# EAGLE design v1.1 (EAGLE 9.0.1)
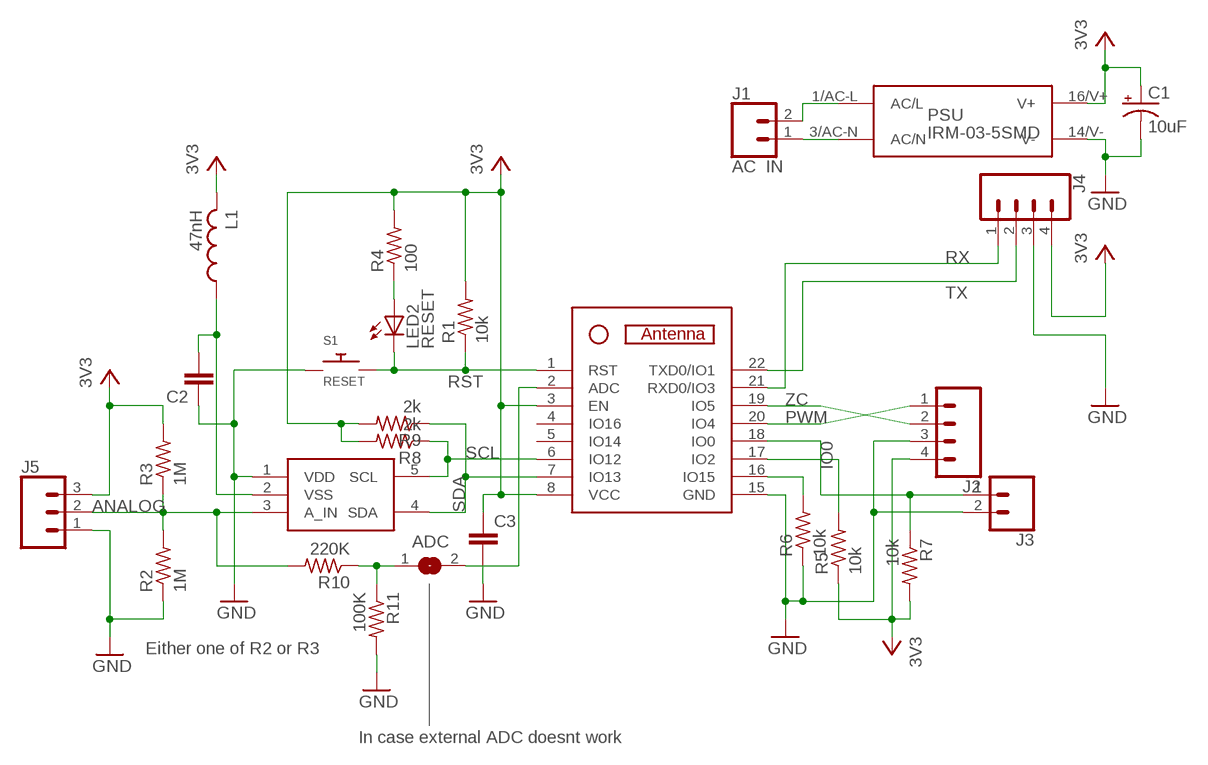
[diagram p0: schematic, sheet 1]

## Parts
ADC  SJ  [SJ]
C1  10uF  CPOL-US153CLV-0405  [153CLV-0405]
C2  C-EUC0805  [C0805]
C3  C-EUC0805  [C0805]
J1  AC IN  1X2_5MM_SCREW  [1X2_5MM_SCREW]
J2  CONN_04  [1X04]
J3  CONN_02  [1X02]
J4  CONN_04  [1X04]
J5  CONN_03  [1X03]
L1  47nH  L-USL2012C  [L2012C]
LED2  RESET  LEDSML0805  [SML0805]
PSU  IRM-03-5SMD  [IRM-03-5S]
R1  10k  R-US_R0603  [R0603]
R2  1M  R-US_R0603  [R0603]
R3  1M  R-US_R0603  [R0603]
R4  100  R-US_R0805  [R0805]
R5  10k  R-US_R0603  [R0603]
R6  10k  R-US_R0603  [R0603]
R7  10k  R-US_R0603  [R0603]
R8  2k  R-US_R0603  [R0603]
R9  2k  R-US_R0603  [R0603]
R10  220K  R-US_R0603  [R0603]
R11  100K  R-US_R0603  [R0603]
S1  RESET  BUTTON  [TACTILE_SWITCH_SMD_6.2MM_TALL]
U1  ESP-07  [ESP-07]
U2  MCP3221  [SOT23-5]

## Nets
AC/L: J1.2 PSU.1/AC-L(AC/L)
AC/N: J1.1 PSU.3/AC-N(AC/N)
ANALOG: J5.2 R2.2 R3.1 R10.2 U2.3(A_IN)
GND: C1.- C2.1 C3.2 J2.3 J3.2 J4.3 J5.1 PSU.14/V-(V-) R2.1 R6.1 R11.2 S1.A1 S1.A2 U1.15(GND) U2.1(VDD)
IO0: J3.1 R7.1 U1.18(IO0)
N$1: LED2.A R4.1
N$2: R5.2 U1.17(IO2)
N$3: R6.2 U1.16(IO15)
N$4: ADC.1 R10.1 R11.1
N$6: ADC.2 U1.2(ADC)
N$7: C2.2 L1.1 U2.2(VSS)
PWM: J2.1 U1.20(IO4)
RST: LED2.C R1.1 S1.B1 S1.B2 U1.1(RST)
RX: J4.1 U1.21(RXD0/IO3)
SCL: R8.1 U1.6(IO12) U2.5(SCL)
SDA: R9.1 U1.7(IO13) U2.4(SDA)
TX: J4.2 U1.22(TXD0/IO1)
VCC: C1.+ C3.1 J2.4 J4.4 J5.3 L1.2 PSU.16/V+(V+) R1.2 R3.2 R4.2 R5.1 R7.2 R8.2 R9.2 U1.3(EN) U1.8(VCC) ; supply symbol labelled 3V3
ZC: J2.2 U1.19(IO5)
Unconnected: U1.4(IO16) U1.5(IO14)

## Notes on the sheet
- Either one of R2 or R3
- In case external ADC doesnt work

## Library data of the parts
ADC = jumper:SJ: SMD solder JUMPER
C1 = resistor:CPOL-US: POLARIZED CAPACITOR, American symbol
C2 C3 = resistor:C-EU: CAPACITOR, European symbol
J1 = my_parts:1X2_5MM_SCREW
J2 J4 = SparkFun-Connectors:CONN_04: Multi connection point. Often used as Generic Header-pin footprint for 0.1 inch spaced/style header connections On any of the 0.1 inch spaced packages, you can populate with these: Break Away Headers - Straight <https://www.sparkfun.com/products/116> (PRT-00116) Break Away Male Headers - Right Angle <https://www.sparkfun.com/products/553> (PRT-00553) Female Headers <https://www.sparkfun.com/products/115> (PRT-00115) Break Away Headers - Machine Pin <https://www.sparkfun.com/products/117> (PRT-00117) Break Away Female Headers - Swiss Machine Pin <https://www.sparkfun.com/products/743> (PRT-00743) For SCREWTERMINALS and SPRING TERMINALS visit here: Screw Terimnals on SparkFun.com <https://www.sparkfun.com/search/results?term=Screw+Terminals> (5mm/3.5mm/2.54mm spacing) This device is also useful as a general connection point to wire up your design to another part of your project. Our various solder wires solder well into these plated through hole pads. Hook-Up Wire - Assortment (Stranded, 22 AWG) <https://www.sparkfun.com/products/11375> (PRT-11375) Hook-Up Wire - Assortment (Solid Core, 22 AWG) <https://www.sparkfun.com/products/11367> (PRT-11367) View the entire wire category on our website here <https://www.sparkfun.com/categories/141> Special notes: Molex polarized connector foot print use with SKU : PRT-08231 with associated crimp pins and housings. 1MM SMD Version SKU: PRT-10208; PROD_ID: CONN-09696
J3 = SparkFun-Connectors:CONN_02: Multi connection point. Often used as Generic Header-pin footprint for 0.1 inch spaced/style header connections On any of the 0.1 inch spaced packages, you can populate with these: Break Away Headers - Straight <https://www.sparkfun.com/products/116> (PRT-00116) Break Away Male Headers - Right Angle <https://www.sparkfun.com/products/553> (PRT-00553) Female Headers <https://www.sparkfun.com/products/115> (PRT-00115) Break Away Headers - Machine Pin <https://www.sparkfun.com/products/117> (PRT-00117) Break Away Female Headers - Swiss Machine Pin <https://www.sparkfun.com/products/743> (PRT-00743) For SCREWTERMINALS and SPRING TERMINALS visit here: Screw Terimnals on SparkFun.com <https://www.sparkfun.com/search/results?term=Screw+Terminals> (5mm/3.5mm/2.54mm spacing) This device is also useful as a general connection point to wire up your design to another part of your project. Our various solder wires solder well into these plated through hole pads. Hook-Up Wire - Assortment (Stranded, 22 AWG) <https://www.sparkfun.com/products/11375> (PRT-11375) Hook-Up Wire - Assortment (Solid Core, 22 AWG) <https://www.sparkfun.com/products/11367> (PRT-11367) View the entire wire category on our website here <https://www.sparkfun.com/categories/141> Special notes: Molex polarized connector foot print use with: PRT-08233 with associated crimp pins and housings. 2.54_SCREWTERM for use with PRT-10571. 3.5mm Screw Terminal footprints for PRT-08084 5mm Screw Terminal footprints for use with PRT-08432
J5 = SparkFun-Connectors:CONN_03: Multi connection point. Often used as Generic Header-pin footprint for 0.1 inch spaced/style header connections On any of the 0.1 inch spaced packages, you can populate with these: Break Away Headers - Straight <https://www.sparkfun.com/products/116> (PRT-00116) Break Away Male Headers - Right Angle <https://www.sparkfun.com/products/553> (PRT-00553) Female Headers <https://www.sparkfun.com/products/115> (PRT-00115) Break Away Headers - Machine Pin <https://www.sparkfun.com/products/117> (PRT-00117) Break Away Female Headers - Swiss Machine Pin <https://www.sparkfun.com/products/743> (PRT-00743) Stackable Header - 3 Pin (Female, 0.1") <https://www.sparkfun.com/products/13875> (PRT-13875) For SCREWTERMINALS and SPRING TERMINALS visit here: Screw Terimnals on SparkFun.com <https://www.sparkfun.com/search/results?term=Screw+Terminals> (5mm/3.5mm/2.54mm spacing) This device is also useful as a general connection point to wire up your design to another part of your project. Our various solder wires solder well into these plated through hole pads. Hook-Up Wire - Assortment (Stranded, 22 AWG) <https://www.sparkfun.com/products/11375> (PRT-11375) Hook-Up Wire - Assortment (Solid Core, 22 AWG) <https://www.sparkfun.com/products/11367> (PRT-11367) View the entire wire category on our website here <https://www.sparkfun.com/categories/141> Special notes: Molex polarized connector foot print use with SKU : PRT-08232 with associated crimp pins and housings.
L1 = resistor:L-US: INDUCTOR, American symbol
LED2 = led:LED: LED OSRAM: - CHIPLED LG R971, LG N971, LY N971, LG Q971, LY Q971, LO R971, LY R971 LH N974, LH R974 LS Q976, LO Q976, LY Q976 LO Q996 - Hyper CHIPLED LW Q18S LB Q993, LB Q99A, LB R99A - SideLED LS A670, LO A670, LY A670, LG A670, LP A670 LB A673, LV A673, LT A673, LW A673 LH A674 LY A675 LS A676, LA A676, LO A676, LY A676, LW A676 LS A679, LY A679, LG A679 - Hyper Micro SIDELED® LS Y876, LA Y876, LO Y876, LY Y876 LT Y87S - SmartLED LW L88C, LW L88S LB L89C, LB L89S, LG L890 LS L89K, LO L89K, LY L89K LS L896, LA L896, LO L896, LY L896 - TOPLED LS T670, LO T670, LY T670, LG T670, LP T670 LSG T670, LSP T670, LSY T670, LOP T670, LYG T670 LG T671, LOG T671, LSG T671 LB T673, LV T673, LT T673, LW T673 LH T674 LS T676, LA T676, LO T676, LY T676, LB T676, LH T676, LSB T676, LW T676 LB T67C, LV T67C, LT T67C, LS T67K, LO T67K, LY T67K, LW E67C LS E67B, LA E67B, LO E67B, LY E67B, LB E67C, LV E67C, LT E67C LW T67C LS T679, LY T679, LG T679 LS T770, LO T770, LY T770, LG T770, LP T770 LB T773, LV T773, LT T773, LW T773 LH T774 LS E675, LA E675, LY E675, LS T675 LS T776, LA T776, LO T776, LY T776, LB T776 LHGB T686 LT T68C, LB T68C - Hyper Mini TOPLED® LB M676 - Mini TOPLED Santana® LG M470 LS M47K, LO M47K, LY M47K Source: http://www.osram.convergy.de LUXEON: - LUMILED® LXK2-PW12-R00, LXK2-PW12-S00, LXK2-PW14-U00, LXK2-PW14-V00 LXK2-PM12-R00, LXK2-PM12-S00, LXK2-PM14-U00 LXK2-PE12-Q00, LXK2-PE12-R00, LXK2-PE12-S00, LXK2-PE14-T00, LXK2-PE14-U00 LXK2-PB12-K00, LXK2-PB12-L00, LXK2-PB12-M00, LXK2-PB14-N00, LXK2-PB14-P00, LXK2-PB14-Q00 LXK2-PR12-L00, LXK2-PR12-M00, LXK2-PR14-Q00, LXK2-PR14-R00 LXK2-PD12-Q00, LXK2-PD12-R00, LXK2-PD12-S00 LXK2-PH12-R00, LXK2-PH12-S00 LXK2-PL12-P00, LXK2-PL12-Q00, LXK2-PL12-R00 Source: www.luxeon.com KINGBRIGHT: KA-3528ASYC Source: www.kingbright.com
PSU = my_parts:IRM-03-5
R1-R11 = resistor:R-US_: RESISTOR, American symbol
S1 = my_parts:BUTTON
U1 = my_parts:ESP-07
U2 = my_parts:MCP3221

## Board
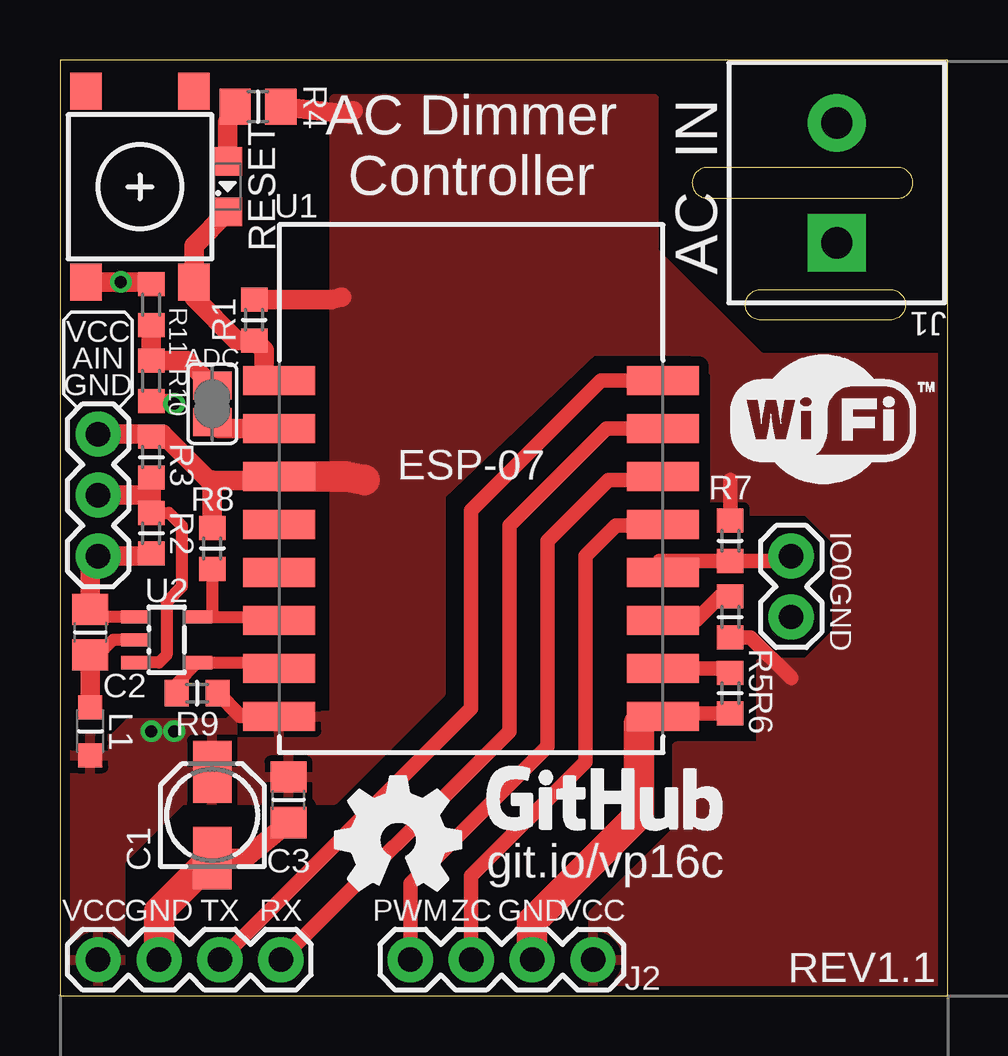
[diagram p1: board, top side]
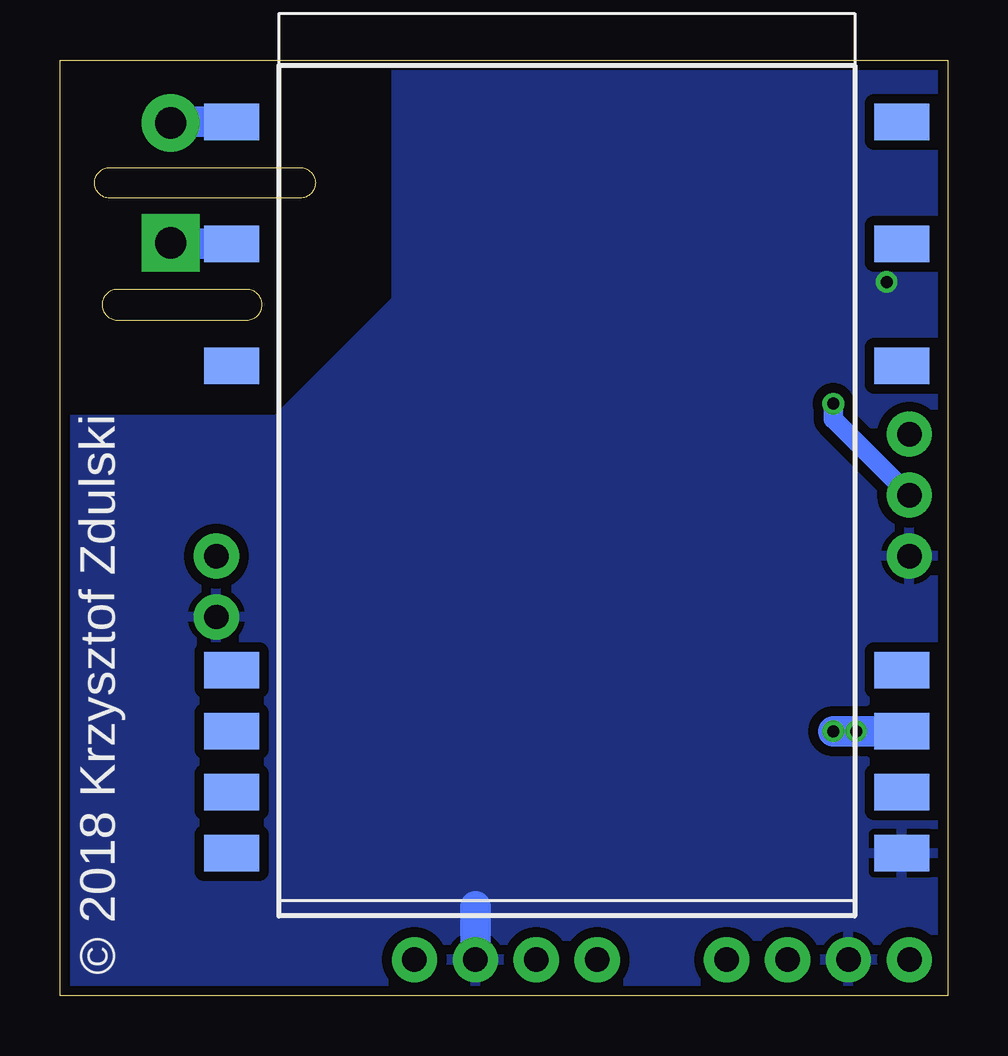
[diagram p2: board, bottom side, seen from below]

Size 37 x 39 mm. Coordinates in mm from the lower left corner, seen from the top.
Outline: 0,0 37,0 37,39 0,39 0,0
Outline: 34.92,34.51 26.99,34.51 arc180 26.99,33.24 34.92,33.24 arc180 34.92,34.51
Outline: 29.21,29.43 34.61,29.43 arc-180 34.61,28.16 29.21,28.16 arc-180 29.21,29.43
Copper layers (1*16): Top 0.035mm / dielectric 1.5mm / Bottom 0.035mm
Design rules "default *": minimum track width 6mil, minimum drill 0.35mm, track to track 6mil, track to pad 6mil, pad to pad 6mil, via to via 6mil, smd to smd 6mil, copper to edge 16mil, drill to drill 6mil, minimum pad ring 10mil, minimum via ring 8mil, stop-mask expansion 4mil, vias tented up to drill 0.6mm, thermal gap 10mil

### Footprints (pad centres in the part's own frame; a part is rotated, then mirrored left to right if it is on the bottom)
SJ = smd 1.168 x 1.6: 1 -0.762,0; 2 0.762,0
153CLV-0405 = smd 2.6 x 1.6: + 1.8,0; - -1.8,0
C0805 = smd 1.3 x 1.5: 1 -0.95,0; 2 0.95,0
1X2_5MM_SCREW = drill 1.3 pad 2.4 square: 1 2.5,0 | drill 1.3 pad 2.4: 2 -2.5,0
1X04 = drill 1.016 pad 1.88: 1 0,0; 2 2.54,0; 3 5.08,0; 4 7.62,0
1X02 = drill 1.016 pad 1.88: 1 0,0; 2 2.54,0
1X03 = drill 1.016 pad 1.88: 1 0,0; 2 2.54,0; 3 5.08,0
L2012C = smd 1 x 1: 1 -1,0; 2 1,0
SML0805 = smd 1.2 x 1.2: A 1.05,0; C -1.05,0
IRM-03-5S = smd 1.524 x 2.286: 1/AC-L -13.97,-13.97; 3/AC-N -8.89,-13.97; 5 -3.81,-13.97; 10 8.89,-13.97; 11 11.43,-13.97; 12 13.97,-13.97; 13 16.51,-13.97; 14/V- 16.51,13.97; 15 13.97,13.97; 16/V+ 11.43,13.97; 17 8.89,13.97; 22 -3.81,13.97; 24 -8.89,13.97; 26 -13.97,13.97
R0603 = smd 1 x 1.1: 1 -0.85,0; 2 0.85,0
R0805 = smd 1.3 x 1.5: 1 -0.95,0; 2 0.95,0
TACTILE_SWITCH_SMD_6.2MM_TALL = smd 1.55 x 1.3: A1 -3.975,-2.25; A2 3.975,-2.25; B1 -3.975,2.25; B2 3.975,2.25
ESP-07 = smd 3 x 1.2: 1 -8,3.5; 2 -8,1.5; 3 -8,-0.5; 4 -8,-2.5; 5 -8,-4.5; 6 -8,-6.5; 7 -8,-8.5; 8 -8,-10.5; 15 8,-10.5; 16 8,-8.5; 17 8,-6.5; 18 8,-4.5; 19 8,-2.5; 20 8,-0.5; 21 8,1.5; 22 8,3.5
SOT23-5 = smd 0.55 x 1.2: 1 -0.95,-1.3; 2 0,-1.3; 3 0.95,-1.3; 4 0.95,1.3; 5 -0.95,1.3

### Placement (x,y rotation side)
ADC  6.35,24.67 270 top
C1  6.35,7.53 90 top
C2  1.27,15.14 270 top
C3  9.53,8.16 270 top
J1  32.38,33.88 270 top
J2  14.61,1.49 0 top
J3  30.48,18.32 270 top
J4  9.21,1.49 180 top
J5  1.59,18.32 90 top
L1  1.27,11.02 270 top
LED2  6.99,33.72 90 top
PSU  15.88,22.45 270 bottom
R1  8.1,28.16 90 top
R2  3.81,19.27 90 top
R3  3.81,22.45 90 top
R4  8.26,37.05 0 top
R5  27.94,15.78 90 top
R6  27.94,12.61 90 top
R7  27.94,18.95 90 top
R8  6.35,18.64 90 top
R9  5.71,12.61 0 top
R10  3.81,25.62 270 top
R11  3.81,28.8 90 top
S1  3.33,33.72 270 top
U1  17.14,22.13 0 top
U2  4.45,14.83 270 top

### Tracks (layer width: path | path; a pad name or v marks a point on that pad's centre or on a via)
AC/L
  Bottom 1.27: PSU.1/AC-L 32.34,36.42 J1.2
AC/N
  Bottom 1.27: PSU.3/AC-N 32.34,31.34 J1.1
ANALOG  (via drill 0.5)
  Top 0.508: R2.2 4.55,20.12 5.08,19.59 5.08,17.05 4.45,16.41 4.45,14.19 4.13,13.88 U2.3
  Top 0.61: R10.2 4.66,24.77 v4.76,24.67
  Top 0.813: R3.1 3.81,20.86 | 3.81,20.86 R2.2 | J5.2 3.81,20.86
  Bottom 0.813: v4.76,24.67 4.76,24.04 J5.2
GND  (via drill 0.5)
  Top 0.508: U2.1 1.59,15.78 C2.1
  Top 0.61: R6.1 25.27,11.76 U1.15
  Top 0.813: R2.1 3.71,18.32 J5.1 1.27,18 C2.1 | C3.2 7.72,5.72 C1.- | S1.A2 1.91,29.74 v2.54,29.75 3.71,29.75 R11.2
  Top 1.016: 24.13,11.34 24.43,11.63 U1.15
  Top 1.27: C1.- 4.13,3.5 J4.3 | J2.3 19.68,3.08 24.13,7.53 24.13,11.34
  Bottom 1.27: J2.3 19.68,3.71
  pour Bottom (isolate 0.406): 0,0 0,39 23,39 23,29 28,24 37,24 37,0
IO0
  Top 0.61: 29.95,18.11 J3.1 30.27,18.11 R7.1 24.98,18.11 U1.18
N$1
  Top 0.813: R4.1 6.99,36.41 LED2.A
N$2
  Top 0.61: U1.17 26.52,15.63 27.62,16.73 27.84,16.73 R5.2
N$3
  Top 0.61: U1.16 27.45,13.63 R6.2
N$4
  Top 0.813: R11.1 R10.1 5.31,26.47 ADC.1
N$6
  Top 0.813: ADC.2 6.63,23.63 U1.2
N$7
  Top 0.508: U2.2 2.22,14.83 1.59,14.19 1.34,14.2 C2.2
  Top 0.813: C2.2 L1.1
PWM
  Top 0.61: U1.20 24.38,21.5 22.86,21.5 20.32,18.95 20.32,10.38 14.61,4.67 J2.1
RST
  Top 0.813: U1.1 8.5,25.62 8.5,26.91 R1.1 7.36,27.31 5.58,29.09 S1.B2 5.58,31.27 LED2.C
RX
  Top 0.61: J4.1 18.73,11.02 18.73,19.59 22.77,23.63 U1.21
SCL
  Top 0.508: U2.5 6.35,15.78 | 6.35,15.78 9,15.78 U1.6 | R8.1 6.35,15.78
SDA
  Top 0.508: U1.7 8.9,13.88 U2.4 4.87,13 R9.1
TX
  Top 0.152: 24.3,25.63 U1.22
  Top 0.61: J4.2 17.14,11.97 17.14,20.23 22.55,25.63 24.3,25.63
VCC  (via drill 0.5)
  Top 0.61: R7.2 27.94,21.5 | R5.1 28.79,14.93 30.48,13.24 | R9.2 7.52,11.65 7.62,11.65
  Top 0.813: 8.23,21.47 7.94,21.5 | R1.2 11.33,29.01 11.75,29.11 | J5.3 3.91,23.4 | 3.91,23.4 4.03,23.4 | 4.03,23.4 R3.2 3.91,23.4 | U1.3 8.23,21.47 | 8.23,21.47 6.21,21.47 | 6.21,21.47 4.29,23.4 4.03,23.4 | R8.2 6.35,21.5 6.21,21.47 | R4.2 12.06,36.73 12.22,36.89
  Top 1.27: U1.3 11.93,21.63 12.7,21.5
  Bottom 1.27: PSU.16/V+ v3.81,11.02 v4.76,11.02
  pour Top (isolate 0.406): 2.54,-0.09 2.54,5.62 5.08,8.16 11.43,8.16 15.88,12.61 15.88,20.86 22.23,26.89 26.35,26.89 27.3,25.94 27.3,20.23 31.11,20.23 32.38,18.95 32.38,15.14 31.11,13.88 29.21,13.88 29.21,10.38 25.72,10.38 25.72,6.89 22.23,3.4 22.23,-0.09 36.83,-0.09 36.83,26.57 29.21,26.57 24.77,31.02 24.77,37.37 11.43,37.37 11.43,11.65 7.3,11.65 6.99,11.34 2.86,11.34 2.22,10.7 0,10.7 0,-0.09
ZC
  Top 0.61: J2.2 17.14,4.99 21.91,9.75 21.91,18.32 23.18,19.59 24.47,19.59 U1.19

### Text on the board
_tplace: AC Dimmer / Controller | VCC | AIN | GND | IO0 | GND | git.io/vp16c | VCC | GND | TX | RX | PWM | ZC | GND | VCC | REV1.1
_bplace: © 2018 Krzysztof Zdulski